# EAGLE design float003 (EAGLE 6.2)
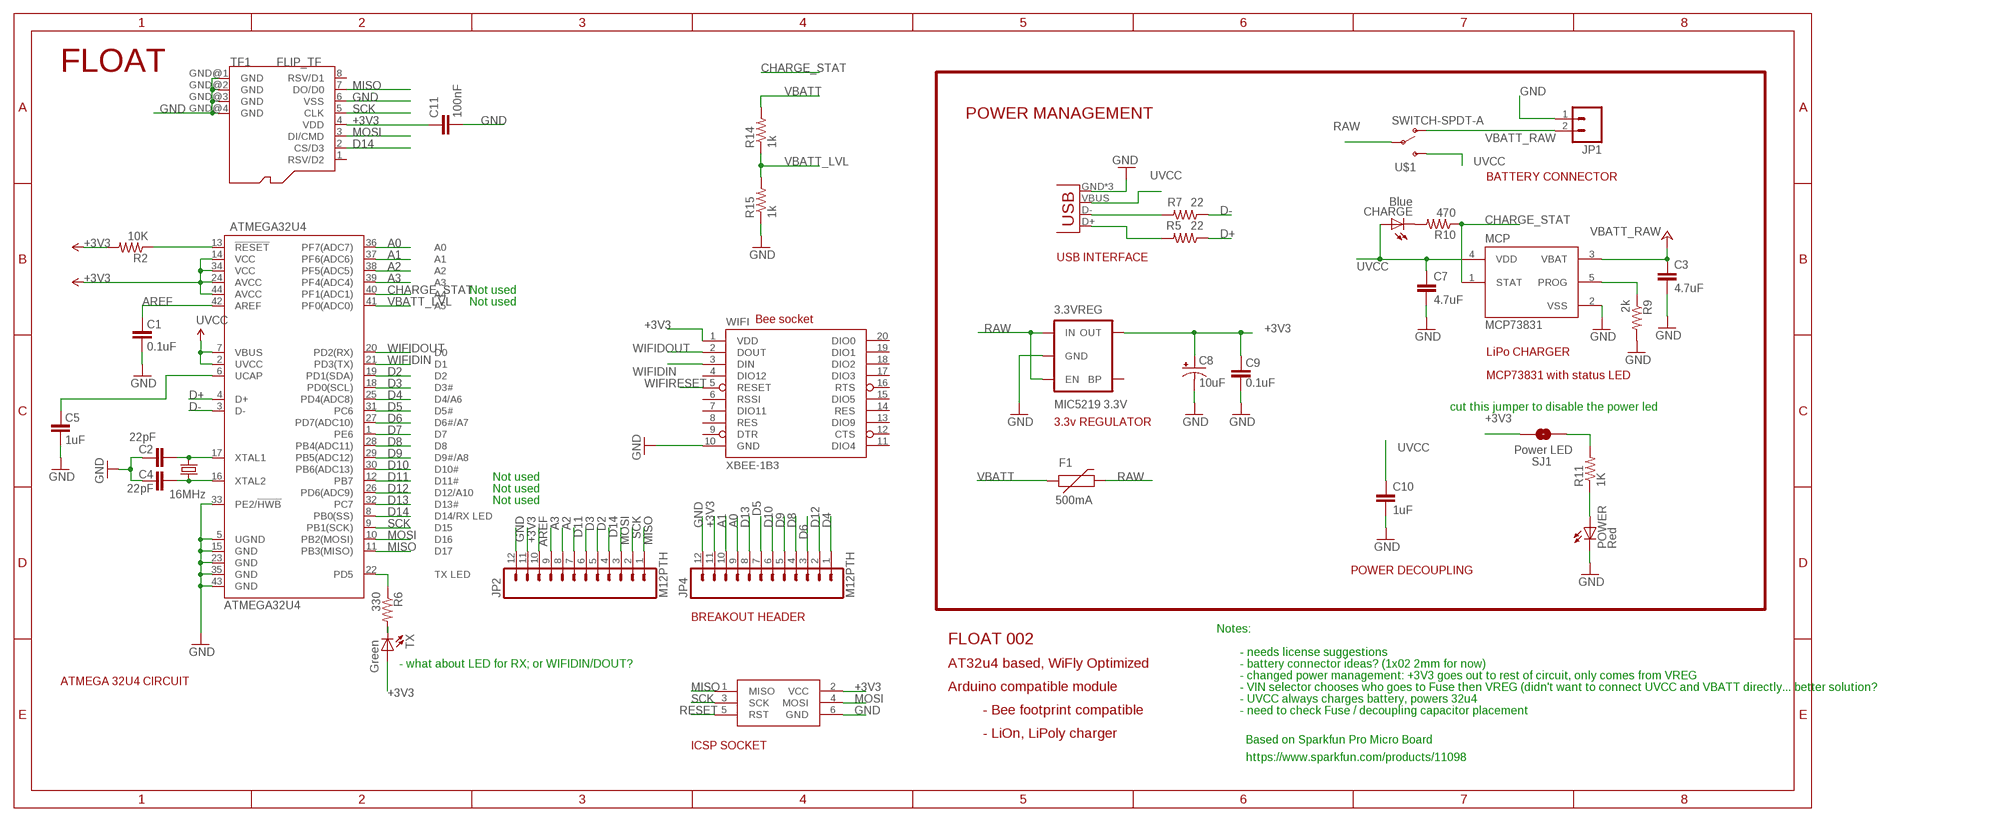
[diagram p0: schematic, sheet 1]

## Parts
3.3VREG  MIC5219 3.3V  V_REG_MIC52193.3V  [SOT23-5]
ATMEGA32U4  ATMEGA32U4  ATMEGA32U4QFN2  [QFN-44-NOPAD]
C1  0.1uF  CAP0402-CAP  [0402-CAP]
C2  22pF  CAP0402-CAP  [0402-CAP]
C3  4.7uF  .1UF-CER  [0402-CAP]
C4  22pF  CAP0402-CAP  [0402-CAP]
C5  1uF  CAP0402-CAP  [0402-CAP]
C7  4.7uF  .1UF-CER  [0402-CAP]
C8  10uF  CAP_POL1206  [EIA3216]
C9  0.1uF  CAP0402-CAP  [0402-CAP]
C10  1uF  CAP0402-CAP  [0402-CAP]
C11  100nF  CAP0402-CAP  [0402-CAP]
CHARGE  Blue  LED0603  [LED-0603]
F1  500mA  PTCSMD  [PTC-1206]
ISP1  AVRISP-6  [AVRISP]
JP1  M02JST-PTH-2  [JST-2-PTH]
JP2  M12PTH  [1X12]
JP4  M12PTH  [1X12]
MCP  MCP73831  [SOT23-5]
POWER  Red  LED0603  [LED-0603]
R2  10K  RESISTOR0402-RES  [0402-RES]
R5  22  RESISTOR0402-RES  [0402-RES]
R6  330  RESISTOR0402-RES  [0402-RES]
R7  22  RESISTOR0402-RES  [0402-RES]
R9  2k  RESISTOR0402-RES  [0402-RES]
R10  470  RESISTOR0402-RES  [0402-RES]
R11  1K  RESISTOR0402-RES  [0402-RES]
R14  1k  RESISTOR0402-RES  [0402-RES]
R15  1k  RESISTOR0402-RES  [0402-RES]
SJ1  Power LED  SOLDERJUMPERTRACE  [SJ_2S-TRACE]
TF1  FLIP_TF  [FLIP_TF]
TX  Green  LED0603  [LED-0603]
U$1  SWITCH-SPDT-A  [SWITCH-SPDT-A]
WIFI  XBEE-1B3  [XBEE-SMD]
X2  USB-MICROB  [USB-MICROB]
Y1  16MHz  CRYSTAL5X3  [CRYSTAL-SMD-5X3]

## Nets
+3V3: 3.3VREG.5(OUT) ATMEGA32U4.14(VCC) ATMEGA32U4.24(AVCC) ATMEGA32U4.34(VCC) ATMEGA32U4.44(AVCC) C8.A(+) C9.2 C11.1 ISP1.2(VCC) JP2.11 JP4.11 R2.2 SJ1.2 TF1.4(VDD) TX.A WIFI.1(VDD) ; supply symbol labelled VCC
A0: ATMEGA32U4.36(PF7(ADC7)) JP4.9
A1: ATMEGA32U4.37(PF6(ADC6)) JP4.10
A2: ATMEGA32U4.38(PF5(ADC5)) JP2.8
A3: ATMEGA32U4.39(PF4(ADC4)) JP2.9
AREF: ATMEGA32U4.42(AREF) C1.2 JP2.10
CHARGE_STAT: ATMEGA32U4.40(PF1(ADC1)) MCP.1(STAT) R10.1
D2: ATMEGA32U4.19(PD1(SDA)) JP2.5
D3: ATMEGA32U4.18(PD0(SCL)) JP2.6
D4: ATMEGA32U4.25(PD4(ADC8)) JP4.1
D5: ATMEGA32U4.31(PC6) JP4.7
D6: ATMEGA32U4.27(PD7(ADC10)) JP4.3
D7: ATMEGA32U4.1(PE6)
D8: ATMEGA32U4.28(PB4(ADC11)) JP4.4
D9: ATMEGA32U4.29(PB5(ADC12)) JP4.5
D10: ATMEGA32U4.30(PB6(ADC13)) JP4.6
D11: ATMEGA32U4.12(PB7) JP2.7
D12: ATMEGA32U4.26(PD6(ADC9)) JP4.2
D13: ATMEGA32U4.32(PC7) JP4.8
D14: ATMEGA32U4.8(PB0(SS)) JP2.4 TF1.2(CS/D3)
D+: ATMEGA32U4.4(D+) R5.1
D-: ATMEGA32U4.3(D-) R7.1
GND [vcc]: 3.3VREG.2(GND) ATMEGA32U4.5(UGND) ATMEGA32U4.15(GND) ATMEGA32U4.23(GND) ATMEGA32U4.33(PE2/!HWB) ATMEGA32U4.35(GND) ATMEGA32U4.43(GND) C1.1 C2.2 C3.2 C4.2 C5.1 C7.2 C8.C(-) C9.1 C10.2 C11.2 ISP1.6(GND) JP1.1 JP2.12 JP4.12 MCP.2(VSS) POWER.C R9.2 R15.1 TF1.6(VSS) TF1.GND@1(GND) TF1.GND@2(GND) TF1.GND@3(GND) TF1.GND@4(GND) WIFI.10(GND) X2.GND X2.MT1(GND) X2.MT2(GND)
MISO: ATMEGA32U4.11(PB3(MISO)) ISP1.1(MISO) JP2.1 TF1.7(DO/D0)
MOSI: ATMEGA32U4.10(PB2(MOSI)) ISP1.4(MOSI) JP2.3 TF1.3(DI/CMD)
N$1: ATMEGA32U4.16(XTAL2) C4.1 Y1.1
N$2: ATMEGA32U4.17(XTAL1) C2.1 Y1.3
N$3: CHARGE.C R10.2
N$4: ATMEGA32U4.6(UCAP) C5.2
N$6: R7.2 X2.D-
N$7: R6.2 TX.C
N$8: R5.2 X2.D+
N$9: MCP.5(PROG) R9.1
N$22: R11.2 SJ1.1
N$38: POWER.A R11.1
RAW: 3.3VREG.1(IN) 3.3VREG.3(EN) F1.2 U$1.2(P)
RESET: ATMEGA32U4.13(!RESET) ISP1.5(RST) R2.1
SCK: ATMEGA32U4.9(PB1(SCK)) ISP1.3(SCK) JP2.2 TF1.5(CLK)
TXLED: ATMEGA32U4.22(PD5) R6.1
UVCC: ATMEGA32U4.2(UVCC) ATMEGA32U4.7(VBUS) C7.1 C10.1 CHARGE.A MCP.4(VDD) U$1.1(S) X2.VBUS
VBATT: F1.1 R14.2
VBATT_LVL: ATMEGA32U4.41(PF0(ADC0)) R14.1 R15.2
VBATT_RAW: C3.1 JP1.2 MCP.3(VBAT) U$1.3(O) ; supply symbol labelled VBATT
WIFIDIN: ATMEGA32U4.21(PD3(TX)) WIFI.3(DIN)
WIFIDOUT: ATMEGA32U4.20(PD2(RX)) WIFI.2(DOUT)
WIFIRESET: WIFI.5(RESET)
Unconnected: 3.3VREG.4(BP) TF1.1(RSV/D2) TF1.8(RSV/D1) WIFI.4(DIO12) WIFI.6(RSSI) WIFI.7(DIO11) WIFI.8(RES) WIFI.9(DTR) WIFI.11(DIO4) WIFI.12(CTS) WIFI.13(DIO9) WIFI.14(RES) WIFI.15(DIO5) WIFI.16(RTS) WIFI.17(DIO3) WIFI.18(DIO2) WIFI.19(DIO1) WIFI.20(DIO0)

## Notes on the sheet
- FLOAT
- POWER MANAGEMENT
- BATTERY CONNECTOR
- USB INTERFACE
- Not used
- Not used
- Bee socket
- LiPo CHARGER
- MCP73831 with status LED
- cut this jumper to disable the power led
- 3.3v REGULATOR
- Not used
- Not used
- Not used
- POWER DECOUPLING
- BREAKOUT HEADER
- Notes:
- FLOAT 002
- - needs license suggestions
- - what about LED for RX; or WIFIDIN/DOUT? | AT32u4 based, WiFly Optimized | - battery connector ideas? (1x02 2mm for now)
- - changed power management: +3V3 goes out to rest of circuit, only comes from VREG
- ATMEGA 32U4 CIRCUIT
- Arduino compatible module | - VIN selector chooses who goes to Fuse then VREG (didn't want to connect UVCC and VBATT directly... better solution?
- - UVCC always charges battery, powers 32u4
- - Bee footprint compatible | - need to check Fuse / decoupling capacitor placement
- - LiOn, LiPoly charger
- Based on Sparkfun Pro Micro Board
- ICSP SOCKET
- https://www.sparkfun.com/products/11098

## Library data of the parts
3.3VREG = SparkFun-PowerIC:V_REG_MIC5219: V_REG MIC5219 Standard 500mA LDO voltage regulator in SOT-23 layout. Micrel part MIC5219. BP (by-pass) pin is used to lower output noise with 470pF cap, may be left open.; PROD_ID: VREG-09872
ATMEGA32U4 = SparkFun-DigitalIC:ATMEGA32U4: Atmel 44-pin 8-bit Microcontroller with 32KBytes of ISP Flash and USB Controller
C1 C2 C4 C5 C9 C10 = SparkFun:CAP: Capacitor Standard 0603 ceramic capacitor, and 0.1" leaded capacitor.
C3 C7 = SparkFun-Capacitors:.1UF-CER: .1uF ceramic SMT CAP-00810- 25V +80%/-20% (0603) CAP-08390- 100V 10% (0603) CAP-08604- 25V 5% (0603); PROD_ID: CAP-00810; VALUE: 0.1uF
C8 = SparkFun:CAP_POL: Capacitor Polarized These are standard SMD and PTH capacitors. Normally 10uF, 47uF, and 100uF in electrolytic and tantalum varieties. Always verify the external diameter of the through hole cap, it varies with capacity, voltage, and manufacturer. The EIA devices should be standard.
C11 = SparkFun-Passives:CAP: Capacitor Standard 0603 ceramic capacitor, and 0.1" leaded capacitor.
CHARGE POWER TX = SparkFun:LED: LEDs Standard schematic elements and footprints for 5mm, 3mm, 1206, and 0603 sized LEDs. 5mm - Spark Fun Electronics SKU : COM-00529 (and others)
F1 = SparkFun:PTC: Resettable Fuse PTC Resettable Fuse. Spark Fun Electronics SKU : COM-08357
ISP1 = adafruit:AVRISP: AVR ISP HEADER Standard 6 pin header for AVR programming
JP1 = SparkFun-Connectors:M02: Header 2 Standard 2-pin 0.1" header. Use with straight break away headers (SKU : PRT-00116), right angle break away headers (PRT-00553), swiss pins (PRT-00743), machine pins (PRT-00117), and female headers (PRT-00115). Molex polarized connector foot print use with SKU : PRT-08233 with associated crimp pins and housings.
JP2 JP4 = SparkFun-Connectors:M12: Header 12 Standard 12-pin 0.1" header. Use with straight break away headers (SKU : PRT-00116), right angle break away headers (PRT-00553), swiss pins (PRT-00743), machine pins (PRT-00117), and female headers (PRT-00115).
MCP = ze_ic:MCP73831: Microchip 73831 Li-Poly charger IC
R2 R5-R7 R11 R14 R15 = SparkFun:RESISTOR: Resistor Basic schematic elements and footprints for 0603, 1206, and PTH resistors.
R9 R10 = SparkFun-Resistors:RESISTOR: Resistor Basic schematic elements and footprints for 0603, 1206, and PTH resistors.
SJ1 = SparkFun:SOLDERJUMPER: Solder Jumper Standard SMD solder jumper. Used to automate production. Two varients : Normally Open and Normally Closed are the same, but have different paste layers. NC will have a large amount of paste and should jumper during reflow.
TF1 = Holders:FLIP_TF: http://garden.seeedstudio.com/images/e/e4/Flip_TF_Holder.jpg
U$1 = SparkFun-Electromechanical:SWITCH-SPDT-A
WIFI = SparkFun-RF:XBEE-1: Xbee module footprints SMT header is CONN-09042.; PROD_ID: CONN-09042
X2 = SparkFun-Connectors:USB: USB Connectors USB-B-PTH is fully proven SKU : PRT-00139/CONN-08278 USB-miniB is fully proven SKU : PRT-00587 USB-A-PCB is untested. USB-A-H is throughly reviewed, but untested. Spark Fun Electronics SKU : PRT-00437 USB-B-SMT is throughly reviewed, but untested. Needs silkscreen touching up. USB-A-S has not been used/tested USB-MB-H has not been used/tested USB-MICROB has been used. CONN-09505; PROD_ID: CONN-09505
Y1 = SparkFun:CRYSTAL: Crystals Various standard crystals. Proven footprints. Spark Fun Electronics SKU : COM-00534

## Net classes
0 default: width 0.003 mm, drill 0.254 mm, clearance 0.152 mm

## Board
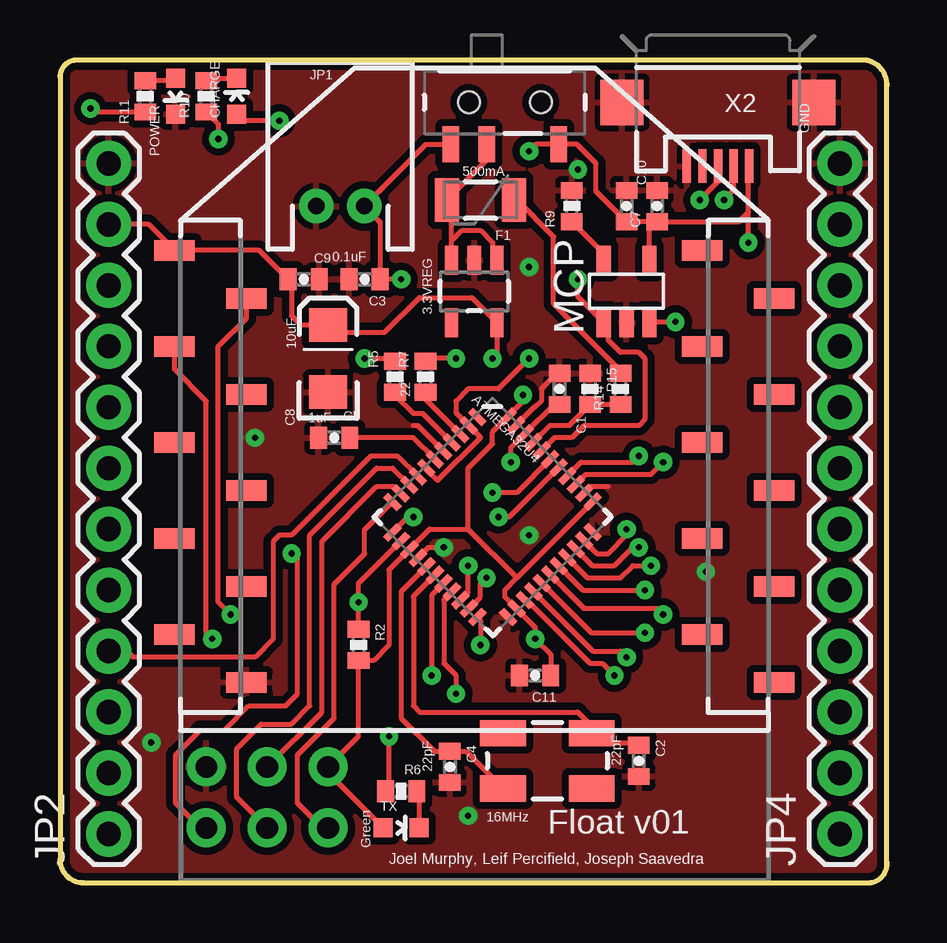
[diagram p1: board, top side]
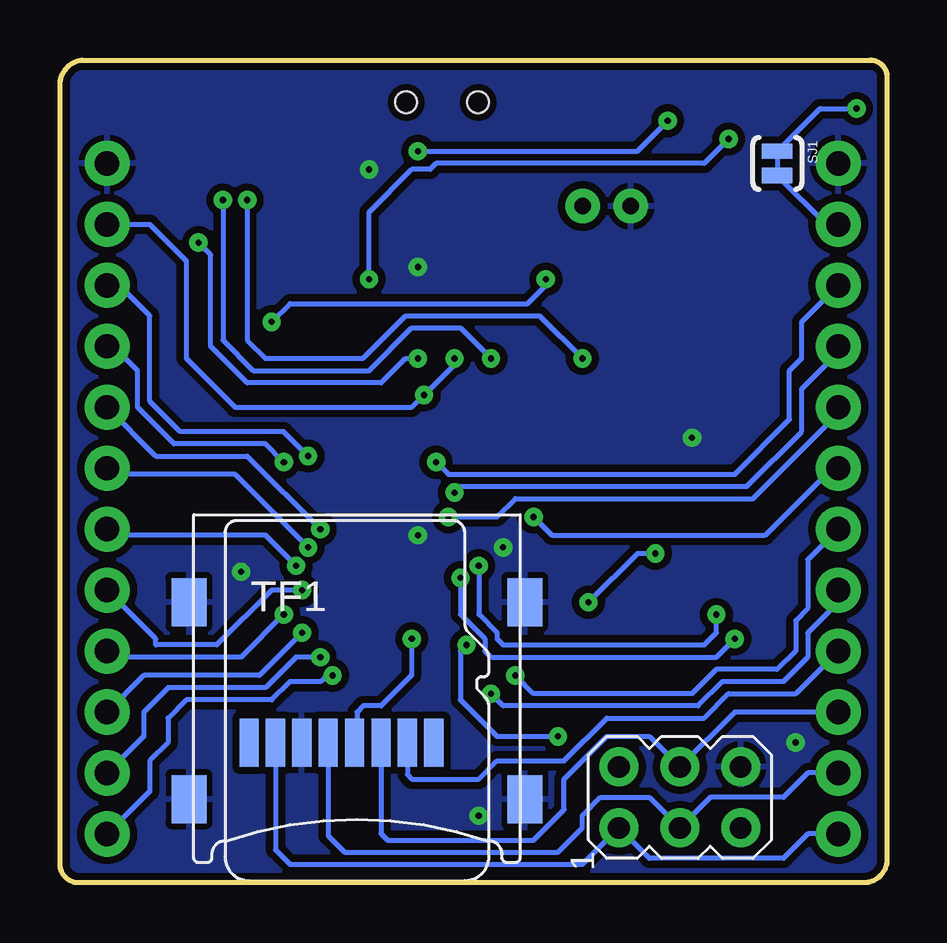
[diagram p2: board, bottom side, seen from below]

Size 34.48 x 34.28 mm. Coordinates in mm from the lower left corner, seen from the top.
Outline: 0,0.97 arc90 0.97,0 33.8,0 arc90 34.47,0.92 34.47,33.11 arc90 33.55,34.28 0.71,34.28 arc90 0,33.57 0,0.97
Copper layers (1*16): Top 0.035mm / dielectric 1.5mm / Bottom 0.035mm
Design rules: minimum track width 8mil, minimum drill 20mil, track to track 8mil, track to pad 8mil, pad to pad 8mil, via to via 8mil, smd to smd 8mil, copper to edge 10mil, drill to drill 8mil, minimum pad ring 12mil, minimum via ring 10mil, stop-mask expansion 4mil, vias tented up to drill 25mil, thermal gap 10mil

### Footprints (pad centres in the part's own frame; a part is rotated, then mirrored left to right if it is on the bottom)
SOT23-5 = smd 0.55 x 1.2: 1 -0.95,-1.3; 2 0,-1.3; 3 0.95,-1.3; 4 0.95,1.3; 5 -0.95,1.3
QFN-44-NOPAD = smd 0.8 x 0.3: 1 -3.4,2.5; 2 -3.4,2; 3 -3.4,1.5; 4 -3.4,1; 5 -3.4,0.5; 6 -3.4,0; 7 -3.4,-0.5; 8 -3.4,-1; 9 -3.4,-1.5; 10 -3.4,-2; 11 -3.4,-2.5; 23 3.4,-2.5; 24 3.4,-2; 25 3.4,-1.5; 26 3.4,-1; 27 3.4,-0.5; 28 3.4,0; 29 3.4,0.5; 30 3.4,1; 31 3.4,1.5; 32 3.4,2; 33 3.4,2.5 | smd 0.3 x 0.8: 12 -2.5,-3.4; 13 -2,-3.4; 14 -1.5,-3.4; 15 -1,-3.4; 16 -0.5,-3.4; 17 0,-3.4; 18 0.5,-3.4; 19 1,-3.4; 20 1.5,-3.4; 21 2,-3.4; 22 2.5,-3.4; 34 2.5,3.4; 35 2,3.4; 36 1.5,3.4; 37 1,3.4; 38 0.5,3.4; 39 0,3.4; 40 -0.5,3.4; 41 -1,3.4; 42 -1.5,3.4; 43 -2,3.4; 44 -2.5,3.4
0402-CAP = smd 0.7 x 0.9: 1 -0.65,0; 2 0.65,0
EIA3216 = smd 1.4 x 1.6: A 1.4,0; C -1.4,0
LED-0603 = smd 0.8 x 0.8: A 0,-0.75; C 0,0.75
PTC-1206 = smd 1 x 1.8: 1 -1.4,0; 2 1.4,0
AVRISP = drill 0.9 pad 1.626: 1 -1.27,2.54; 2 1.27,2.54; 3 -1.27,0; 4 1.27,0; 5 -1.27,-2.54; 6 1.27,-2.54
JST-2-PTH = drill 0.7 pad 1.448: 1 -1,0; 2 1,0
1X12 = drill 1.016 pad 1.88: 1 0,0; 2 2.54,0; 3 5.08,0; 4 7.62,0; 5 10.16,0; 6 12.7,0; 7 15.24,0; 8 17.78,0; 9 20.32,0; 10 22.86,0; 11 25.4,0; 12 27.94,0
SOT23-5' = smd 0.6 x 1.2: 1 -0.95,-1.306; 2 0,-1.306; 3 0.95,-1.306; 4 0.95,1.306; 5 -0.95,1.306
0402-RES = smd 0.7 x 0.9: 1 -0.65,0; 2 0.65,0
SJ_2S-TRACE = smd 0.635 x 1.27: 1 -0.508,0; 2 0.508,0
FLIP_TF = smd 0.8 x 2: 1 3.2,0.25; 2 2.1,0.25; 3 1,0.25; 4 -0.1,0.25; 5 -1.2,0.25; 6 -2.3,0.25; 7 -3.4,0.25; 8 -4.5,0.25 | smd 1.45 x 2: GND@1 -7,6.1; GND@2 -7,-2.1; GND@3 7,-2.1; GND@4 7,6.1
SWITCH-SPDT-A = smd 0.7 x 1.5: 1 2.25,-1.75; 2 -0.75,-1.75; 3 -2.25,-1.75 | hole 0.9: -1.5,0; 1.5,0
XBEE-SMD = smd 1.7 x 0.85: 1 -12.5,20; 2 -9.5,18; 3 -12.5,16; 4 -9.5,14; 5 -12.5,12; 6 -9.5,10; 7 -12.5,8; 8 -9.5,6; 9 -12.5,4; 10 -9.5,2; 11 12.5,2; 12 9.5,4; 13 12.5,6; 14 9.5,8; 15 12.5,10; 16 9.5,12; 17 12.5,14; 18 9.5,16; 19 12.5,18; 20 9.5,20
USB-MICROB = smd 0.35 x 1.4: D+ 0,2.65; D- -0.65,2.65; GND 1.3,2.65; ID 0.65,2.65; VBUS -1.3,2.65 | smd 1.8 x 1.9: MT1 -4,0; MT2 4,0
CRYSTAL-SMD-5X3 = smd 1.9 x 1.1: 1 -1.85,-1.15; 2 1.85,-1.15; 3 1.85,1.15; 4 -1.85,1.15

### Placement (x,y rotation side)
3.3VREG  17.27,24.64 180 top
ATMEGA32U4  18.03,15.24 315.1 top
C1  20.83,20.57 270 top
C2  24.13,5.08 270 top
C3  12.7,25.15 180 top
C4  16.26,4.83 270 top
C5  11.43,18.54 0 top
C7  24.89,28.19 90 top
C8  11.18,21.84 90 top
C9  10.16,25.15 180 top
C10  23.62,28.19 90 top
C11  19.81,8.64 180 top
CHARGE  7.37,32.77 0 top
F1  17.53,28.45 180 top
ISP1  8.64,3.56 90 bottom
JP1  11.68,28.19 0 top
JP2  2.03,2.03 90 top
JP4  32.51,2.03 90 top
MCP  MCP73831  [SOT23-5']  23.62,24.64 0 top
POWER  4.83,32.77 180 top
R2  12.45,9.91 270 top
R5  13.97,21.08 90 top
R6  14.22,3.81 0 top
R7  15.24,21.08 90 top
R9  21.34,28.19 90 top
R10  6.1,32.77 90 top
R11  3.56,32.77 270 top
R14  23.37,20.57 90 top
R15  22.1,20.57 270 top
SJ1  4.57,29.97 270 bottom
TF1  22.1,5.59 0 bottom
TX  14.22,2.29 270 top
U$1  18.54,32.51 0 top
WIFI  17.27,6.35 0 top
X2  27.43,32.51 180 top
Y1  20.32,5.08 0 top

### Tracks (layer width: path | path; a pad name or v marks a point on that pad's centre or on a via)
+3V3  (via drill 0.25)
  Top 0.203: 19.05,12.7 18.54,12.19 18.54,11.91 ATMEGA32U4.24 19.81,10.64 v19.81,10.16 20.46,9.51 C11.1 | 19.05,12.7 22.2,15.85 ATMEGA32U4.34 | 17.02,14.73 15.41,14.73 ATMEGA32U4.14 13.72,13.03 13.72,9.91 13.07,9.26 R2.2 12.45,6.1 ISP1.2 11.18,4.58 TX.A | 17.02,14.73 19.05,12.7 | JP2.11 3.69,27.43 WIFI.1 8.31,26.35 C9.2 9.65,25 9.65,23.62 10.03,23.24 C8.A 11.49,22.93 13.53,22.93 14.99,24.38 17.18,24.38 3.3VREG.5 18.22,22.03 v18.03,21.84 | v19.3,20.32 19.3,20.05 ATMEGA32U4.44 18.03,18.78 18.03,18.29 17.02,17.27 17.02,14.73
  Bottom 0.203: v18.03,21.84 18.03,21.59 v19.3,20.32 19.81,19.81 27.18,19.81 29.21,21.84 29.21,25.91 30.73,27.43 JP4.11 | v19.81,10.16 19.81,8.64 21.08,7.37 21.84,7.37 22.1,7.11 22.1,5.94 TF1.4 | SJ1.2 2.54,27.43 JP2.11
A0  (via drill 0.25)
  Top 0.203: ATMEGA32U4.36 21.92,17.02 24.64,17.02 v25.15,17.53
  Bottom 0.203: v25.15,17.53 25.91,18.29 29.72,18.29 31.24,19.81 31.24,21.34 32.26,22.35 JP4.9
A1  (via drill 0.25)
  Top 0.203: ATMEGA32U4.37 21.73,17.53 23.88,17.53 v24.13,17.78
  Bottom 0.203: v24.13,17.78 25.15,18.8 29.46,18.8 30.73,20.07 30.73,23.62 32,24.89 JP4.10
A2  (via drill 0.25)
  Top 0.203: ATMEGA32U4.38 18.73,15.24 v18.29,15.24
  Bottom 0.203: v18.29,15.24 16.26,15.24 15.49,16 5.59,16 2.03,19.56 JP2.8
A3  (via drill 0.25)
  Top 0.203: ATMEGA32U4.39 19.05,16.26 v18.03,16.26
  Bottom 0.203: v18.03,16.26 17.78,16.51 5.84,16.51 3.56,18.8 3.56,20.57 2.03,22.1 JP2.9
AREF  (via drill 0.25)
  Top 0.203: v18.8,17.53 18.8,18.13 ATMEGA32U4.42 20.59,19.92 C1.2
  Bottom 0.203: JP2.10 3.56,23.37 3.56,21.84 4.06,21.34 4.06,19.3 6.35,17.02 18.29,17.02 v18.8,17.53
CHARGE_STAT  (via drill 0.25)
  Top 0.203: MCP.1 22.61,23.27 | 20.08,18.05 ATMEGA32U4.40 20.62,18.54 21.34,18.54 21.84,19.05 24.13,19.05 24.38,19.3 24.38,21.84 24.13,22.1 23.37,22.1 22.86,22.61 22.86,23.14 MCP.1 | R10.1 6.6,31.61 v6.6,30.99 | MCP.1 21.59,24.41 v21.59,25.15
  Bottom 0.203: v6.6,30.99 7.62,29.97 18.8,29.97 19.05,29.72 19.81,29.72 21.59,27.94 v21.59,25.15
D2  (via drill 0.25)
  Top 0.203: ATMEGA32U4.19 16,11.78 16,9.14 16.51,8.64 v16.51,7.87
  Bottom 0.203: JP2.5 2.03,11.68 3.3,10.41 3.3,9.4 4.32,8.38 6.86,8.38 7.87,7.37 16,7.37 v16.51,7.87
D3  (via drill 0.25)
  Top 0.203: ATMEGA32U4.18 15.49,11.98 v15.49,8.64
  Bottom 0.203: JP2.6 3.3,13.46 3.3,11.43 3.81,10.92 3.81,9.65 4.57,8.89 7.11,8.89 8.13,7.87 14.73,7.87 v15.49,8.64
D4  (via drill 0.25)
  Top 0.203: ATMEGA32U4.25 19.46,11.78 22.1,9.14 22.61,9.14 v23.11,8.64
  Bottom 0.203: v23.11,8.64 23.37,8.64 23.62,8.38 24.89,8.38 25.65,7.62 29.21,7.62 29.97,6.86 29.97,5.84 30.73,5.08 30.73,3.81 JP4.1
D5  (via drill 0.25)
  Top 0.203: ATMEGA32U4.31 22.2,13.21 23.11,13.21 23.88,13.97 v24.13,13.97
  Bottom 0.203: v24.13,13.97 27.18,17.02 32.26,17.02 JP4.7
D6  (via drill 0.25)
  Top 0.203: ATMEGA32U4.27 22.16,10.41 v24.38,10.41
  Bottom 0.203: v24.38,10.41 26.16,8.64 30.99,8.64 JP4.3
D8  (via drill 0.25)
  Top 0.203: ATMEGA32U4.28 21.85,11.43 24.89,11.43 v25.15,11.18
  Bottom 0.203: v25.15,11.18 26.92,9.4 32.26,9.4 JP4.4
D9  (via drill 0.25)
  Top 0.203: ATMEGA32U4.29 21.8,12.19 v24.38,12.19
  Bottom 0.203: v24.38,12.19 25.65,12.19 27.94,9.91 30.48,9.91 30.48,10.16 JP4.5
D10  (via drill 0.25)
  Top 0.203: ATMEGA32U4.30 22,12.7 23.37,12.7 23.88,13.21 v24.64,13.21
  Bottom 0.203: v24.64,13.21 25.91,14.48 32.26,14.48 JP4.6
D11  (via drill 0.25)
  Top 0.203: ATMEGA32U4.12 14.51,15.24 v14.73,15.24
  Bottom 0.203: v14.73,15.24 13.97,14.48 5.08,14.48 2.29,17.27 JP2.7
D12  (via drill 0.25)
  Top 0.203: ATMEGA32U4.26 22.22,9.65 23.37,9.65 v23.62,9.4
  Bottom 0.203: v23.62,9.4 24.64,9.4 25.91,8.13 29.97,8.13 30.99,7.11 30.99,6.1 JP4.2
D13  (via drill 0.25)
  Top 0.203: ATMEGA32U4.32 22.39,13.72 22.86,13.72 23.62,14.48 v23.62,14.73
  Bottom 0.203: v23.62,14.73 26.67,17.78 30.48,17.78 JP4.8 32.26,19.56
D14
  Top 0.203: ATMEGA32U4.8 14.07,17.78 12.95,17.78 9.65,14.48 9.14,14.48 8.89,14.22 8.89,10.16 8.13,9.4 3.05,9.4 2.79,9.65 JP2.4
  Bottom 0.203: TF1.2 20,4.5 19.81,4.32 17.02,4.32 16.26,5.08 13.46,5.08 11.68,6.86 7.62,6.86 6.6,7.87 3.81,7.87 JP2.4
D+
  Top 0.203: R5.1 13.97,20.32 14.73,19.56 15.12,19.56 ATMEGA32U4.4
D-
  Top 0.203: R7.1 15.24,20.15 ATMEGA32U4.3
GND  (via drill 0.25)
  Top 0.203: C1.1 20.72,21.22 20.07,20.57 20.07,20.07 19.81,19.81 19.77,19.81 ATMEGA32U4.43 | ATMEGA32U4.5 14.92,19.05 14.73,19.05 | ATMEGA32U4.35 22.12,16.51 22.86,16.51 | ATMEGA32U4.15 15.36,13.97 v16,13.97
  other vias: 3.81,5.84 19.56,14.48 8.13,18.54 19.56,25.65 26.92,12.95 17.02,2.79 21.59,29.72
  pour Top (isolate 0.305): -1.27,34.29 34.54,34.29 34.54,0 -1.27,0.25
  pour Bottom (isolate 0.305): -1.27,34.29 34.54,34.29 34.54,0 -1.27,0.25
MISO
  Top 0.203: ISP1.1 10.92,2.29 9.91,3.3 9.91,5.33 11.43,6.86 11.43,12.45 12.7,13.72 12.7,14.71 ATMEGA32U4.11
  Bottom 0.203: JP2.1 3.3,2.03 4.32,1.02 9.91,1.02 ISP1.1 12.7,0.76 24.89,0.76 25.5,1.37 TF1.7
MOSI
  Top 0.203: ISP1.4 10.92,7.11 10.92,14.22 13.21,16.51 13.93,16.51 ATMEGA32U4.10
  Bottom 0.203: JP2.3 6.35,7.11 ISP1.4 9.91,6.1 11.68,6.1 13.46,4.32 13.46,3.05 14.73,1.78 20.83,1.78 21.1,2.05 TF1.3
N$1
  Top 0.203: Y1.1 16.92,5.48 C4.1 15.61,5.48 14.22,6.86 14.22,12.13 ATMEGA32U4.16
N$2
  Top 0.203: Y1.3 22.58,5.82 | ATMEGA32U4.17 14.73,11.93 14.73,7.37 14.99,7.11 21.59,7.11 22.58,6.12 22.58,5.82 | C2.1 24.04,5.82 22.58,5.82
N$3
  Top 0.203: R10.2 6.2,33.52 CHARGE.C
N$4
  Top 0.203: ATMEGA32U4.6 14.72,18.54 C5.2
N$6  (via drill 0.25)
  Top 0.203: X2.D- 28.08,28.84 v27.69,28.45 | v16.51,21.84 15.35,21.84 R7.2
  Bottom 0.203: v27.69,28.45 27.69,22.61 26.42,21.34 21.59,21.34 19.81,23.11 17.78,23.11 v16.51,21.84
N$7
  Top 0.203: R6.2 14.97,3.71 TX.C
N$8  (via drill 0.25)
  Top 0.203: X2.D+ 27.43,29.21 v26.67,28.45 | v12.7,21.84 13.86,21.84 R5.2
  Bottom 0.203: v26.67,28.45 26.67,22.61 25.91,21.84 21.84,21.84 20.07,23.62 14.48,23.62 v12.7,21.84
N$9
  Top 0.203: MCP.5 22.67,26.21 R9.1
N$22  (via drill 0.25)
  Top 0.203: v1.27,32.26 1.41,32.12 R11.2
  Bottom 0.203: SJ1.1 2.79,32.26 v1.27,32.26
N$38
  Top 0.203: POWER.A 4.73,33.42 R11.1
RAW
  Top 0.203: U$1.2 17.79,30.11 F1.2 16.32,28.25 3.3VREG.3 16.32,26.74 16.76,27.18 17.53,27.18 18.03,26.67 18.03,26.13 3.3VREG.1
RESET  (via drill 0.25)
  Top 0.203: R2.1 v12.45,11.68 12.45,12.47 ATMEGA32U4.13 | ISP1.5 5.84,2.29 4.83,3.3 4.83,5.33 5.84,6.35 6.86,6.35 7.87,7.37 9.4,7.37 9.91,7.87 9.91,13.46 v9.65,13.72
  Bottom 0.203: v9.65,13.72 10.41,13.72 v12.45,11.68
SCK
  Top 0.203: ISP1.3 7.37,3.56 7.37,5.59 8.38,6.6 9.65,6.6 10.41,7.37 10.41,14.48 13.21,17.27 13.87,17.27 ATMEGA32U4.9
  Bottom 0.203: JP2.2 3.3,4.57 4.32,3.56 7.37,3.56 ISP1.3 9.91,3.56 11.94,3.56 12.7,2.79 12.7,2.29 13.72,1.27 22.61,1.27 23.3,1.96 TF1.5
TXLED  (via drill 0.25)
  Top 0.203: ATMEGA32U4.22 17.53,10.95 v17.53,9.91 | R6.1 13.72,3.95 v13.72,6.1
  Bottom 0.203: v17.53,9.91 17.78,9.65 17.78,7.62 16.26,6.1 v13.72,6.1
UVCC  (via drill 0.25)
  Top 0.203: v19.56,30.48 19.84,30.76 U$1.1 21.56,30.76 22.35,29.97 22.35,28.81 C10.1 C7.1 | v9.14,31.75 7.63,31.75 CHARGE.A | ATMEGA32U4.2 17.53,18.57 17.53,18.54 15.75,16.76 15.27,17.24 ATMEGA32U4.7 | C7.1 28.31,27.54 28.7,27.94 | 28.7,27.94 28.7,29.83 X2.VBUS | ATMEGA32U4.2 17.01,19.06 | v28.7,26.67 28.7,27.94 | MCP.4 24.57,27.22 C7.1 | v19.56,21.84 18.29,20.57 17.02,20.57 16.51,20.07 16.51,19.58 ATMEGA32U4.2
  Bottom 0.203: v19.56,30.48 10.41,30.48 v9.14,31.75 | v28.7,26.67 28.19,26.16 28.19,22.35 26.67,20.83 21.08,20.83 20.07,21.84 v19.56,21.84
VBATT
  Top 0.203: R14.2 23.37,21.34 20.57,24.13 20.57,26.92 19.05,28.45 F1.1
VBATT_LVL
  Top 0.203: R14.1 R15.2 21.22,19.05 20.42,19.05 ATMEGA32U4.41
VBATT_RAW  (via drill 0.25)
  Top 0.203: U$1.3 15.25,30.76 JP1.2 13.35,27.53 C3.1 v14.22,25.15 | MCP.3 24.61,23.37 v25.65,23.37
  Bottom 0.203: v25.65,23.37 24.89,24.13 14.99,24.13 14.22,24.89 v14.22,25.15
WIFIDIN  (via drill 0.25)
  Top 0.203: ATMEGA32U4.21 17.53,11.89 17.53,12.45 v17.78,12.7 | v6.35,10.16 6.1,10.41 6.1,20.07 4.77,21.39 WIFI.3
  Bottom 0.203: v17.78,12.7 17.78,11.18 16.76,10.16 16.76,9.65 16.51,9.4 7.11,9.4 v6.35,10.16
WIFIDOUT  (via drill 0.25)
  Top 0.203: ATMEGA32U4.20 17.02,12.09 v17.02,13.21 | v7.11,11.18 6.6,11.68 6.6,22.35 7.77,23.52 WIFI.2
  Bottom 0.203: v17.02,13.21 17.02,11.18 16.26,10.41 16.26,10.16 16,9.91 7.62,9.91 7.11,10.41 v7.11,11.18

### Text on the board
tPlace: GND | Float v01 | Joel Murphy, Leif Percifield, Joseph Saavedra